# EAGLE design isp_adapter (EAGLE 6.4)
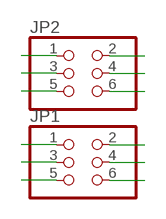
[diagram p0: schematic, sheet 1]

## Parts
JP1  PINHD-2X3  [2X03]
JP2  PINHD-2X3  [2X03]

## Nets
1: JP1.1 JP2.1
2: JP1.2 JP2.2
3: JP1.3 JP2.3
4: JP1.4 JP2.4
5: JP1.5 JP2.5
6: JP1.6 JP2.6

## Library data of the parts
JP1 JP2 = pinhead:PINHD-2X3: PIN HEADER

## Net classes
1 Ground: width 0.1 mm, drill 0.2 mm

## Board
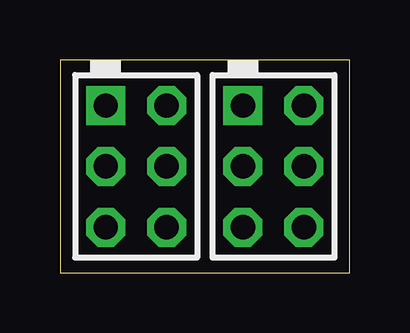
[diagram p1: board, top side]
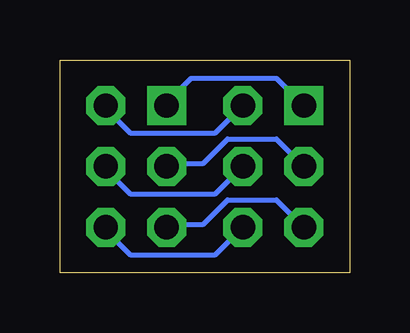
[diagram p2: board, bottom side, seen from below]

Size 12.06 x 8.89 mm. Coordinates in mm from the lower left corner, seen from the top.
Outline: 0,0 12.06,0 12.06,8.89 0,8.89 0,0
Copper layers (1*16): Top 0.035mm / dielectric 1.5mm / Bottom 0.035mm
Design rules "SparkFun *": minimum track width 8mil, minimum drill 20mil, track to track 8mil, track to pad 8mil, pad to pad 8mil, via to via 8mil, smd to smd 8mil, copper to edge 10mil, drill to drill 8mil, minimum pad ring 12mil, minimum via ring 10mil, stop-mask expansion 4mil, vias tented up to drill 25mil, thermal gap 10mil

### Footprints (pad centres in the part's own frame; a part is rotated, then mirrored left to right if it is on the bottom)
2X03 = drill 1.016 square: 1 -2.54,-1.27 | drill 1.016 octagon: 2 -2.54,1.27; 3 0,-1.27; 4 0,1.27; 5 2.54,-1.27; 6 2.54,1.27

### Placement (x,y rotation side)
JP1  3.17,4.44 270 top
JP2  8.89,4.44 270 top

### Tracks (layer width: path | path; a pad name or v marks a point on that pad's centre or on a via)
1
  Bottom 0.203: JP1.1 2.03,7.11 3.05,8.13 6.6,8.13 7.62,7.11 JP2.1
2
  Bottom 0.203: JP1.2 4.57,6.86 5.59,5.84 9.14,5.84 10.16,6.86 JP2.2
3
  Bottom 0.203: JP1.3 2.03,4.57 3.05,5.59 5.08,5.59 6.1,4.57 7.62,4.57 JP2.3
4
  Bottom 0.203: JP1.4 4.57,4.32 5.59,3.3 9.14,3.3 10.16,4.32 JP2.4
5
  Bottom 0.203: JP1.5 2.03,2.03 3.05,3.05 5.08,3.05 6.1,2.03 7.62,2.03 JP2.5
6
  Bottom 0.203: JP1.6 4.57,1.78 5.59,0.76 9.14,0.76 10.16,1.78 JP2.6